# Altium schematic sheet RTU_LMG_Battery_Charger.SchDoc
size A4; SheetNumber: 12; SheetTotal: 15
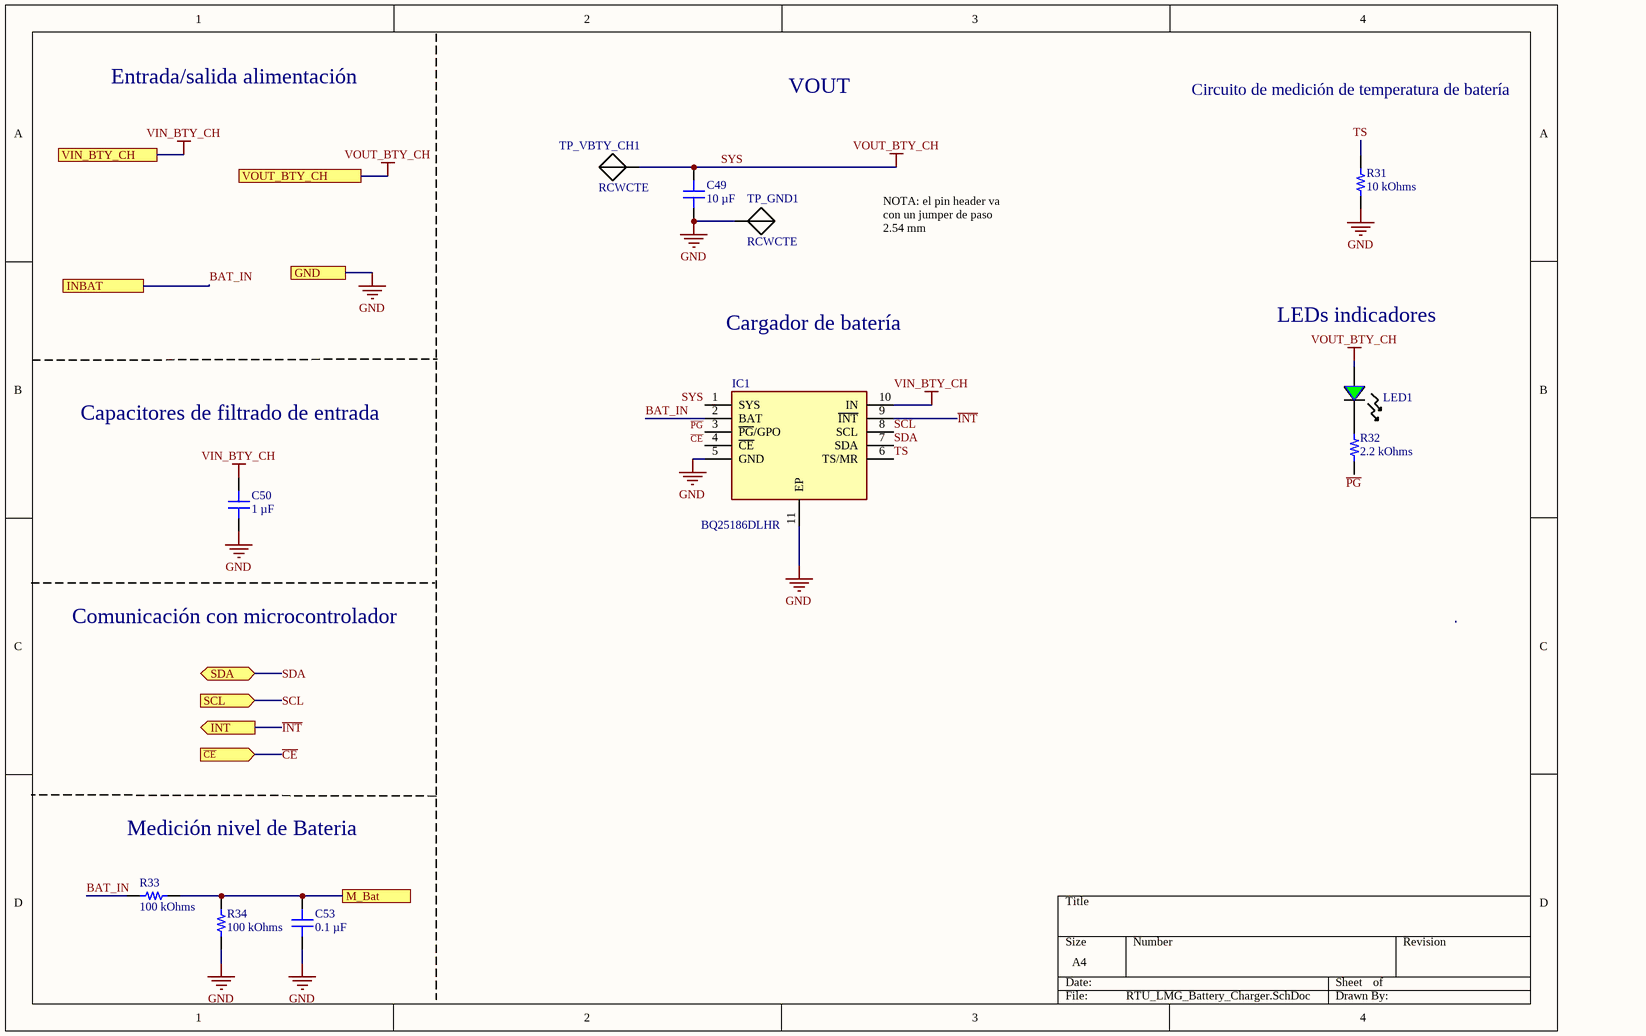
[diagram p0: RTU_LMG_Battery_Charger.SchDoc]

## Parts
C49  10 µF  [CAP 0805_2012]
C50  1 µF  [MURATA GRM155 0402_1005]
C53  0.1 µF  [CAP 0402_1005]
IC1  BQ25186DLHR  [SON40P220X200X80-11N]
LED1  LTST-C170GKT  [0805 SMD - LED]  (value not drawn)
R31  10 kOhms  [RES 0603_1608]
R32  2.2 kOhms  [RES 0402_1005]
R33  100 kOhms  [RES 0402_1005]
R34  100 kOhms  [RES 0402_1005]
TP_GND1  RCWCTE  [RCWCTE]
TP_VBTY_CH1  RCWCTE  [RCWCTE]

## Ports
GND, INBAT, INT (out), M_Bat, SCL (in), SDA (bidir), VIN_BTY_CH, VOUT_BTY_CH, ~{CE} (in)

## Nets
GND: C49.2 C50.1 C53.1 IC1.5(GND) IC1.11(EP) R31.1 R34.2 TP_GND1.1(TP) ; port GND
SYS: C49.1 IC1.1(SYS) LED1.A(ANODE) TP_VBTY_CH1.1(TP) ; port VOUT_BTY_CH  [also labelled VOUT_BTY_CH]
VIN_BTY_CH: C50.2 IC1.10(IN) ; port VIN_BTY_CH
~{CE}: IC1.4(~{CE}) ; port ~{CE}
~{INT}: IC1.9(~{INT}) ; port INT
~{PG}: IC1.3(~{PG}/GPO) R32.1
BAT_IN: IC1.2(BAT) R33.1 ; port INBAT
M_Bat: C53.2 R33.2 R34.1 ; port M_Bat
SCL: IC1.8(SCL) ; port SCL
SDA: IC1.7(SDA) ; port SDA
TS: IC1.6(TS/MR) R31.2
NetLED1_K: LED1.K(CATHODE) R32.2

## Notes on the sheet
- Entrada/salida alimentación
- VOUT
- Circuito de medición de temperatura de batería
- NOTA: el pin header va con un jumper de paso 2.54 mm
- Cargador de batería
- (near LED1) LEDs indicadores
- Capacitores de filtrado de entrada
- Comunicación con microcontrolador
- Medición nivel de Bateria

## Library data of the parts
C49 = CL21A106KOQNNNE: CAP CER 10UF 16V X5R 0805; manufacturer: Samsung Electro-Mechanics; Tolerance: ±10%; Part Number: CL21A106KOQNNNE; Value: 10 µF; Applications: General Purpose; Capacitance: 10 µF; componentlink1description: Datasheet; componentlink1url: http://www.samsungsem.com/kr/support/product-search/mlcc/CL21A106KOQNNNE.jsp; componentlink2description: DigiKey Link; componentlink2url: https://www.digikey.com/en/products/detail/samsung-electro-mechanics/CL21A106KOQNNNE/3886754; Device Package: 0805 (2012 Metric); lastupdated: 10/30/2023 7:13:57 PM; Lifecycle Status: Active; Minimum Order: 1; Mounting Type: Surface Mount, MLCC; Operating Temperature: -55°C ~ 85°C; Package / Case: 0805 (2012 Metric); packaging: TapeAndReel; partid: 14297; Part Status: Active; price: 0.01; series: CL; Size / Dimension: 0.079" L x 0.049" W (2.00mm x 1.25mm); Supplier 1: DigiKey; Supplier Part Number 1: 1276-1096-1-ND; Temperature Coefficient: X5R; Thickness (Max): 0.055" (1.40mm); Voltage - Rated: 16V
C50 = GRM155R6YA105KE11D: CAP CER 1UF 35V X5R 0402; manufacturer: Murata Electronics; Tolerance: ±10%; Part Number: GRM155R6YA105KE11D; Value: 1 µF; Applications: General Purpose; Capacitance: 1 µF; componentlink1description: Datasheet; componentlink1url: https://search.murata.co.jp/Ceramy/image/img/A01X/G101/ENG/GRM155R6YA105KE11-01.pdf; componentlink2description: DigiKey Link; componentlink2url: https://www.digikey.com/en/products/detail/murata-electronics/GRM155R6YA105KE11D/4905162; Device Package: 0402 (1005 Metric); lastupdated: 8/27/2024 12:42:54 PM; Lifecycle Status: Active; Minimum Order: 1; Mounting Type: Surface Mount, MLCC; Operating Temperature: -55°C ~ 85°C; Package / Case: 0402 (1005 Metric); packaging: TapeAndReel; partid: 4167; Part Status: Active; price: 0.01; series: GRM; Size / Dimension: 0.039" L x 0.020" W (1.00mm x 0.50mm); Supplier 1: DigiKey; Supplier Part Number 1: 490-10019-1-ND; Temperature Coefficient: X5R; Thickness (Max): 0.024" (0.60mm); Voltage - Rated: 35V
C53 = CGA2B3X5R1H104M050BB: CAP CER 0.1UF 50V X5R 0402; manufacturer: TDK Corporation; Tolerance: ±20%; Part Number: CGA2B3X5R1H104M050BB; Capacitance: 0.1 µF; Applications: Automotive; componentlink1description: Datasheet; componentlink1url: https://product.tdk.com/info/en/catalog/datasheets/mlcc_automotive_general_en.pdf?ref_disty=digikey; componentlink2description: DigiKey Link; componentlink2url: https://www.digikey.com/en/products/detail/tdk-corporation/CGA2B3X5R1H104M050BB/3949450; Device Package: 0402 (1005 Metric); lastupdated: 9/2/2024 20:04:38; Lifecycle Status: Active; Minimum Order: 1; Mounting Type: Surface Mount, MLCC; Operating Temperature: -55°C ~ 85°C; Package / Case: 0402 (1005 Metric); packaging: TapeAndReel; partid: 1792; Part Status: Active; price: 0.01; Ratings: AEC-Q200; series: CGA; Size / Dimension: 0.039" L x 0.020" W (1.00mm x 0.50mm); Supplier 1: DigiKey; Supplier Part Number 1: 445-12214-1-ND; Temperature Coefficient: X5R; Thickness (Max): 0.022" (0.55mm); value: 0.1 µF; Voltage - Rated: 50V
IC1 = BQ25186DLHR: BQ25186 1-Cell, 1A I2C Linear Battery Charger with Power Path, Ship Mode, Shutdown Mode, and Battery Tracking VINDPM; Manufacturer_Name: Texas Instruments; Geometry.Height: 0.8mm; Mouser Part Number: 595-BQ25186DLHR; Mouser Price/Stock: https://www.mouser.co.uk/ProductDetail/Texas-Instruments/BQ25186DLHR?qs=efUn273yAheZpfz2mNbAWQ%3D%3D; Manufacturer_Part_Number: BQ25186DLHR; Datasheet Link: https://www.ti.com/lit/ds/symlink/bq25186.pdf?ts=1740508135755&ref_url=https%253A%252F%252Fwww.ti.com%252Fproduct%252FBQ25186
LED1 = LTST-C170GKT: LED verde SMD (0805); Mfr_Name: Wolfspeed; Type: DEV; Copyright: Copyright (C) 2023 Ultra Librarian. All rights reserved.; Manufacturer_Part_Number: LTST-C170GKT; RefDes: RefDes
R31 = RC0603FR-0710KL: RES 10K OHM 1% 1/10W 0603; Manufacturer: Yageo; Power (Watts): 0.1W, 1/10W; Temperature Coefficient: ±100ppm/°C; Part Number: RC0603FR-0710KL; Value: 10 kOhms; ComponentLink1Description: Datasheet; ComponentLink1URL: https://www.yageo.com/upload/media/product/productsearch/datasheet/rchip/PYu-RC_Group_51_RoHS_L_10.pdf; ComponentLink2Description: DigiKey Link; ComponentLink2URL: https://www.digikey.com/en/products/detail/yageo/RC0603FR-0710KL/726880; Composition: Thick Film; Device Package: 0603 (1608 Metric); Features: Moisture Resistant; Height - Seated (Max): 0.022" (0.55mm); LastUpdated: 10/30/2023 7:36:43 PM; Lifecycle Status: Active; Minimum Order: 1; Number of Terminations: 2; Operating Temperature: -55°C ~ 155°C; Package / Case: 0603 (1608 Metric); Packaging: CutTape; PartId: 22599; Part Status: Active; Price: 0.01; Resistance: 10 kOhms; Series: RC_L; Size / Dimension: 0.063" L x 0.031" W (1.60mm x 0.80mm); Supplier 1: DigiKey; Supplier Part Number 1: 311-10.0KHRCT-ND; Supplier Device Package: 0603; Tolerance: ±1%
R32 = ERJ-2RKF2201X: RES SMD 2.2K OHM 1% 1/10W 0402; Manufacturer: Panasonic Electronic Components; Power (Watts): 0.1W, 1/10W; Temperature Coefficient: ±100ppm/°C; Part Number: ERJ-2RKF2201X; Value: 2.2 kOhms; ComponentLink1Description: Datasheet; ComponentLink1URL: https://industrial.panasonic.com/cdbs/www-data/pdf/RDA0000/AOA0000C304.pdf; ComponentLink2Description: DigiKey Link; ComponentLink2URL: https://www.digikey.com/en/products/detail/panasonic-electronic-components/ERJ-2RKF2201X/1746150; Composition: Thick Film; Device Package: 0402 (1005 Metric); Features: Automotive AEC-Q200; Height - Seated (Max): 0.016" (0.40mm); LastUpdated: 10/30/2023 7:25:42 PM; Lifecycle Status: Active; Minimum Order: 1; Number of Terminations: 2; Operating Temperature: -55°C ~ 155°C; Package / Case: 0402 (1005 Metric); Packaging: CutTape; PartId: 19620; Part Status: Active; Price: 0.01; Ratings: AEC-Q200; Resistance: 2.2 kOhms; Series: ERJ-2RK; Size / Dimension: 0.039" L x 0.020" W (1.00mm x 0.50mm); Supplier 1: DigiKey; Supplier Part Number 1: P2.20KLCT-ND; Supplier Device Package: 0402; Tolerance: ±1%
R33 R34 = CRCW0402100KFKED: RES SMD 100K OHM 1% 1/16W 0402; Manufacturer: Vishay Dale; Power (Watts): 0.063W, 1/16W; Temperature Coefficient: ±100ppm/°C; Part Number: CRCW0402100KFKED; Value: 100 kOhms; ComponentLink1Description: Datasheet; ComponentLink1URL: http://www.vishay.com/docs/20035/dcrcwe3.pdf; ComponentLink2Description: DigiKey Link; ComponentLink2URL: https://www.digikey.com/en/products/detail/vishay-dale/CRCW0402100KFKED/1178235; Composition: Thick Film; Device Package: 0402 (1005 Metric); Features: Automotive AEC-Q200; Height - Seated (Max): 0.016" (0.40mm); LastUpdated: 11/2/2023 7:33:14 PM; Lifecycle Status: Active; Minimum Order: 1; Number of Terminations: 2; Operating Temperature: -55°C ~ 155°C; Package / Case: 0402 (1005 Metric); Packaging: CutTape; PartId: 11959; Part Status: Active; Price: 0.01; Ratings: AEC-Q200; Resistance: 100 kOhms; Series: CRCW; Size / Dimension: 0.039" L x 0.020" W (1.00mm x 0.50mm); Supplier 1: DigiKey; Supplier Part Number 1: 541-100KLCT-ND; Supplier Device Package: 0402; Tolerance: ±1%
TP_GND1 TP_VBTY_CH1 = RCWCTE: - PC Test Point - - Plating Surface Mount Mounting Type; MF: KOA Speer; Check_prices: https://www.snapeda.com/parts/RCWCTE/KOA+Speer/view-part/?ref=eda; SnapEDA_Link: https://www.snapeda.com/parts/RCWCTE/KOA+Speer/view-part/?ref=snap; Digi-Key_Part_Number: 2019-RCWCTETR-ND; Value: *; Purchase-URL: https://pricing.snapeda.com/search/part/RCWCTE/?ref=eda; Package: None; MP: RCWCTE